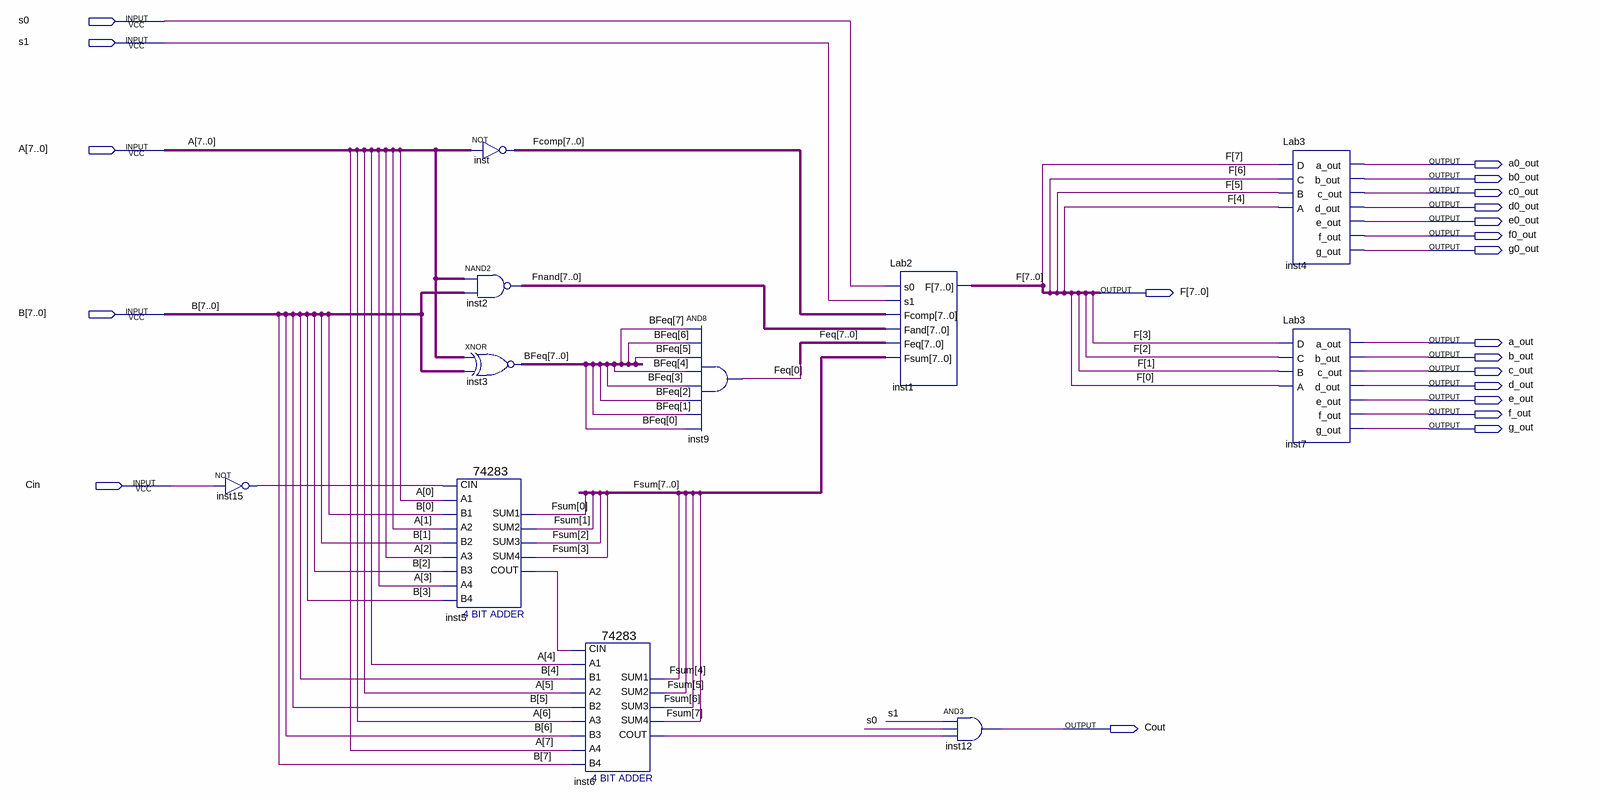
[diagram p0: schematic sheet]
// Quartus schematic ALU.bdf as structural Verilog: 11 symbols, 21 pins
module ALU (
  input  s0,
  input  s1,
  input  [7:0] A,
  input  [7:0] B,
  input  Cin,
  output a0_out,
  output b0_out,
  output c0_out,
  output d0_out,
  output e0_out,
  output f0_out,
  output g0_out,
  output [7:0] F,
  output a_out,
  output b_out,
  output c_out,
  output d_out,
  output e_out,
  output f_out,
  output g_out,
  output Cout
);

  wire inst5_cout, inst6_cout, inst15_out;
  wire [7:0] BFeq, Fcomp, Feq, Fnand, Fsum;

  not inst15 (inst15_out, Cin);
  assign Fcomp = ~A;  // NOT inst, 8 bits wide
  assign Fnand = ~(A & B);  // NAND2 inst2, 8 bits wide
  assign BFeq = ~(A ^ B);  // XNOR inst3, 8 bits wide
  \74283  inst5 (
    .CIN(inst15_out), .A1(A[0]), .A2(A[1]), .B2(B[1]), .A3(A[2]), .A4(A[3]), .B4(B[3]), .B1(B[0]), .B3(B[2]),
    .SUM4(Fsum[3]), .COUT(inst5_cout), .SUM1(Fsum[0]), .SUM2(Fsum[1]), .SUM3(Fsum[2]));
  \74283  inst6 (
    .CIN(inst5_cout), .A1(A[4]), .A2(A[5]), .B2(B[5]), .A3(A[6]), .A4(A[7]), .B4(B[7]), .B1(B[4]), .B3(B[6]),
    .SUM4(Fsum[7]), .COUT(inst6_cout), .SUM1(Fsum[4]), .SUM2(Fsum[5]), .SUM3(Fsum[6]));
  and inst9 (Feq[0], BFeq[7], BFeq[6], BFeq[5], BFeq[4], BFeq[3], BFeq[2], BFeq[1], BFeq[0]);
  Lab2 inst1 (.s0(s0), .s1(s1), .Fcomp(Fcomp), .Fand(Fnand), .Feq(Feq), .Fsum(Fsum), .F(F));
  and inst12 (Cout, s1, s0, inst6_cout);
  Lab3 inst4 (
    .D(F[7]), .C(F[6]), .B(F[5]), .A(F[4]), .a_out(a0_out), .b_out(b0_out), .c_out(c0_out), .d_out(d0_out),
    .e_out(e0_out), .f_out(f0_out), .g_out(g0_out));
  Lab3 inst7 (
    .D(F[3]), .C(F[2]), .B(F[1]), .A(F[0]), .a_out(a_out), .b_out(b_out), .c_out(c_out), .d_out(d_out),
    .e_out(e_out), .f_out(f_out), .g_out(g_out));
endmodule
